# Altium schematic sheet Sheet1.SchDoc (part 1 of 2)
size A2; SheetNumber: 1; SheetTotal: 1
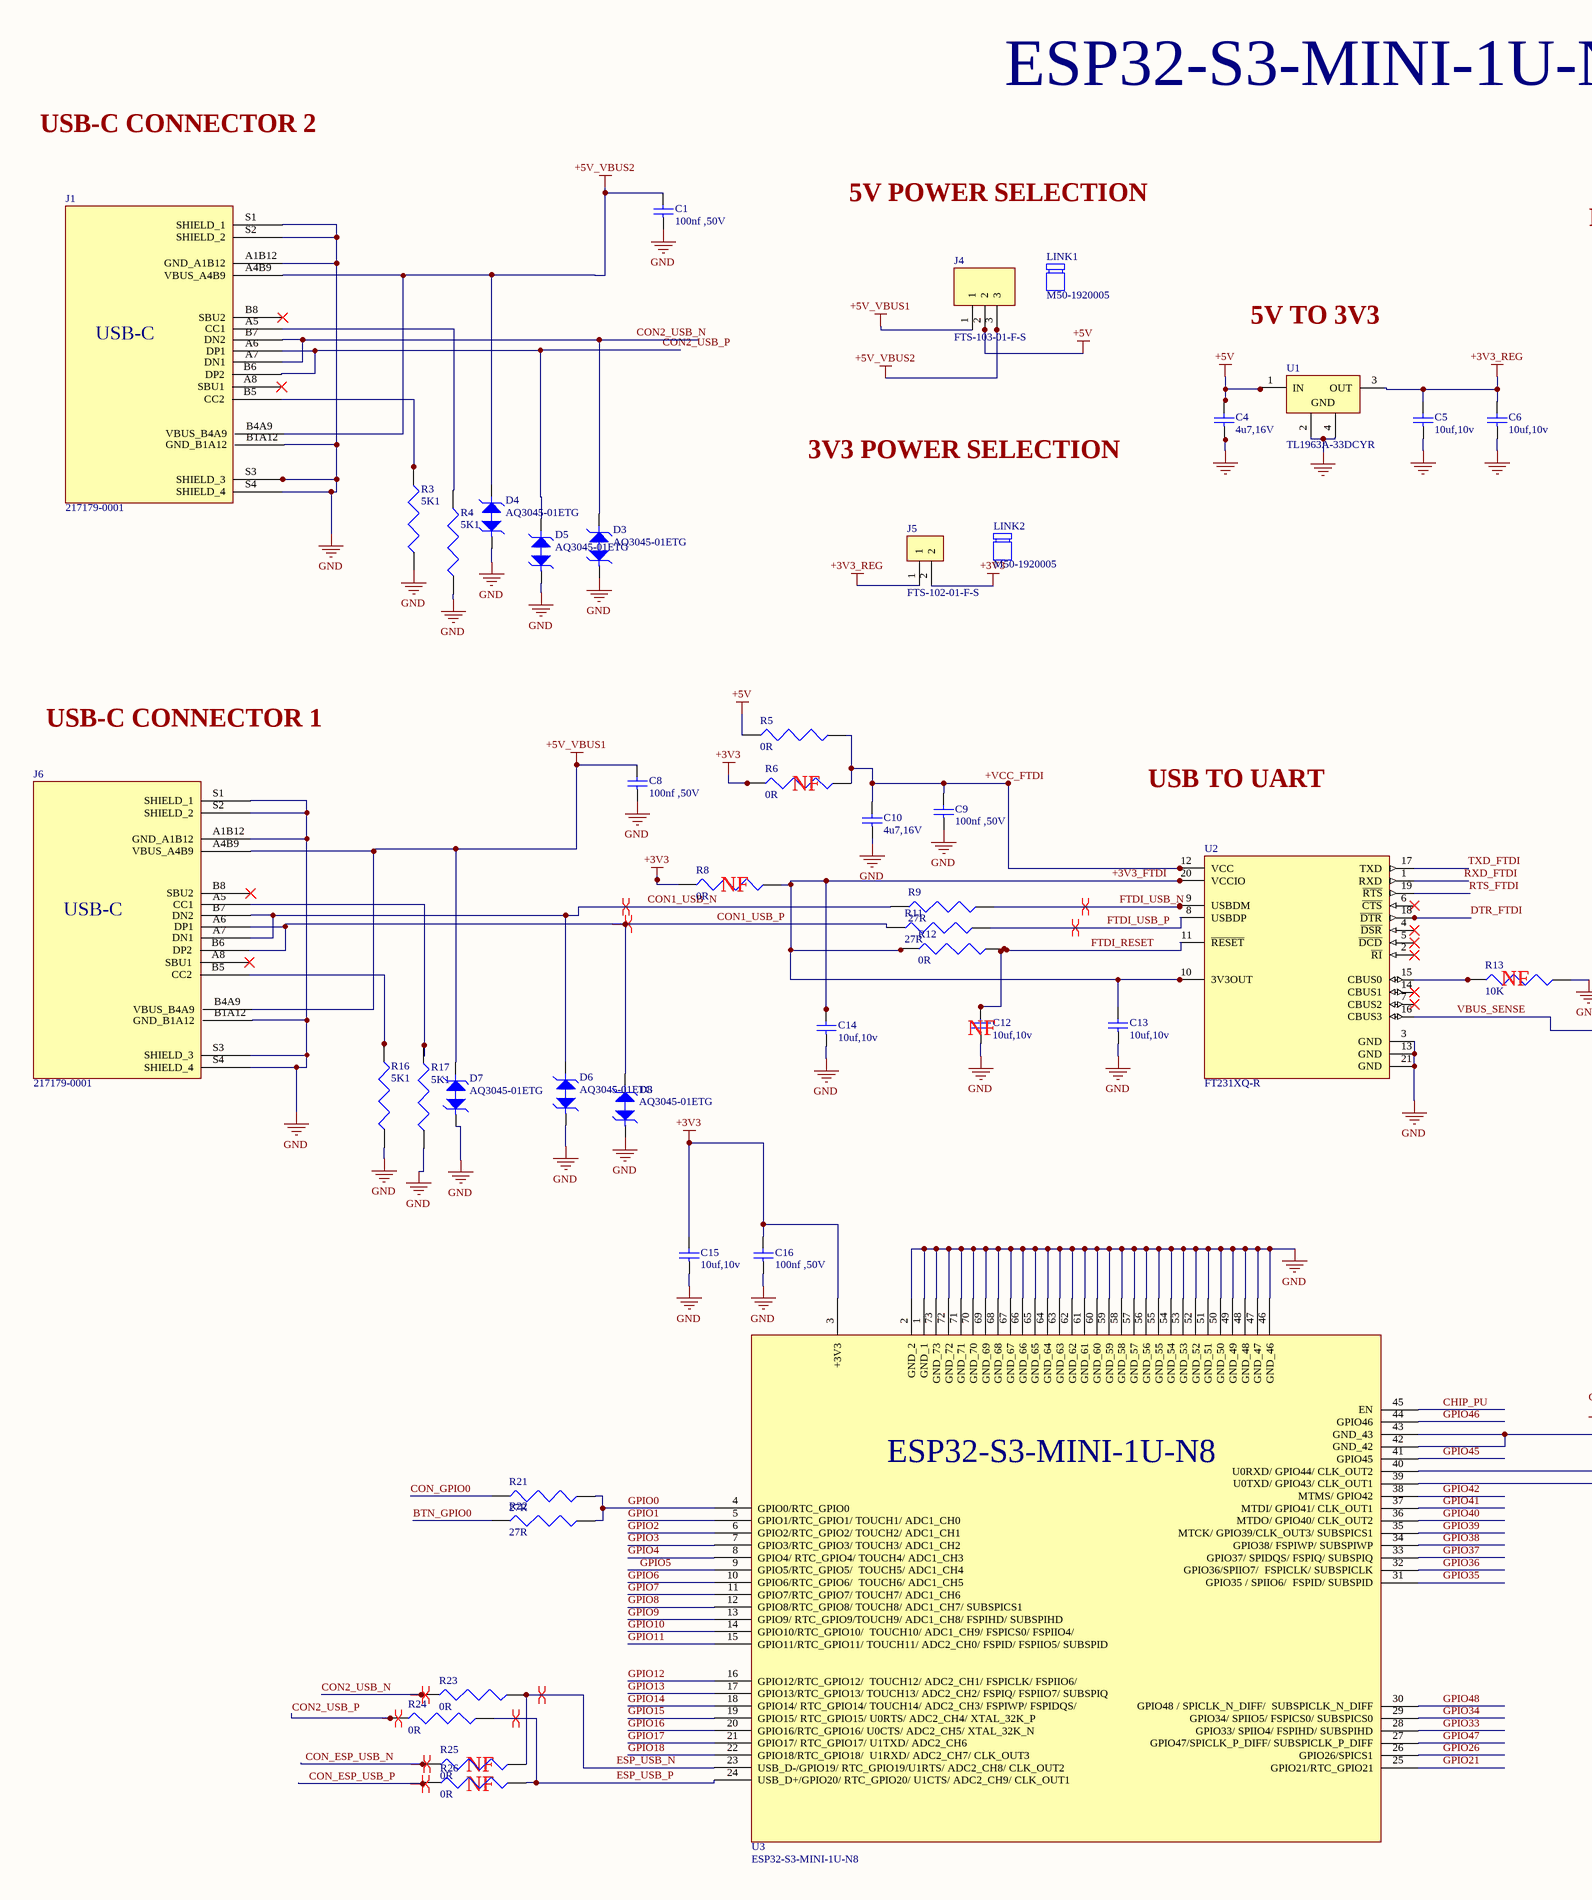
[diagram p0: Sheet1.SchDoc, left]
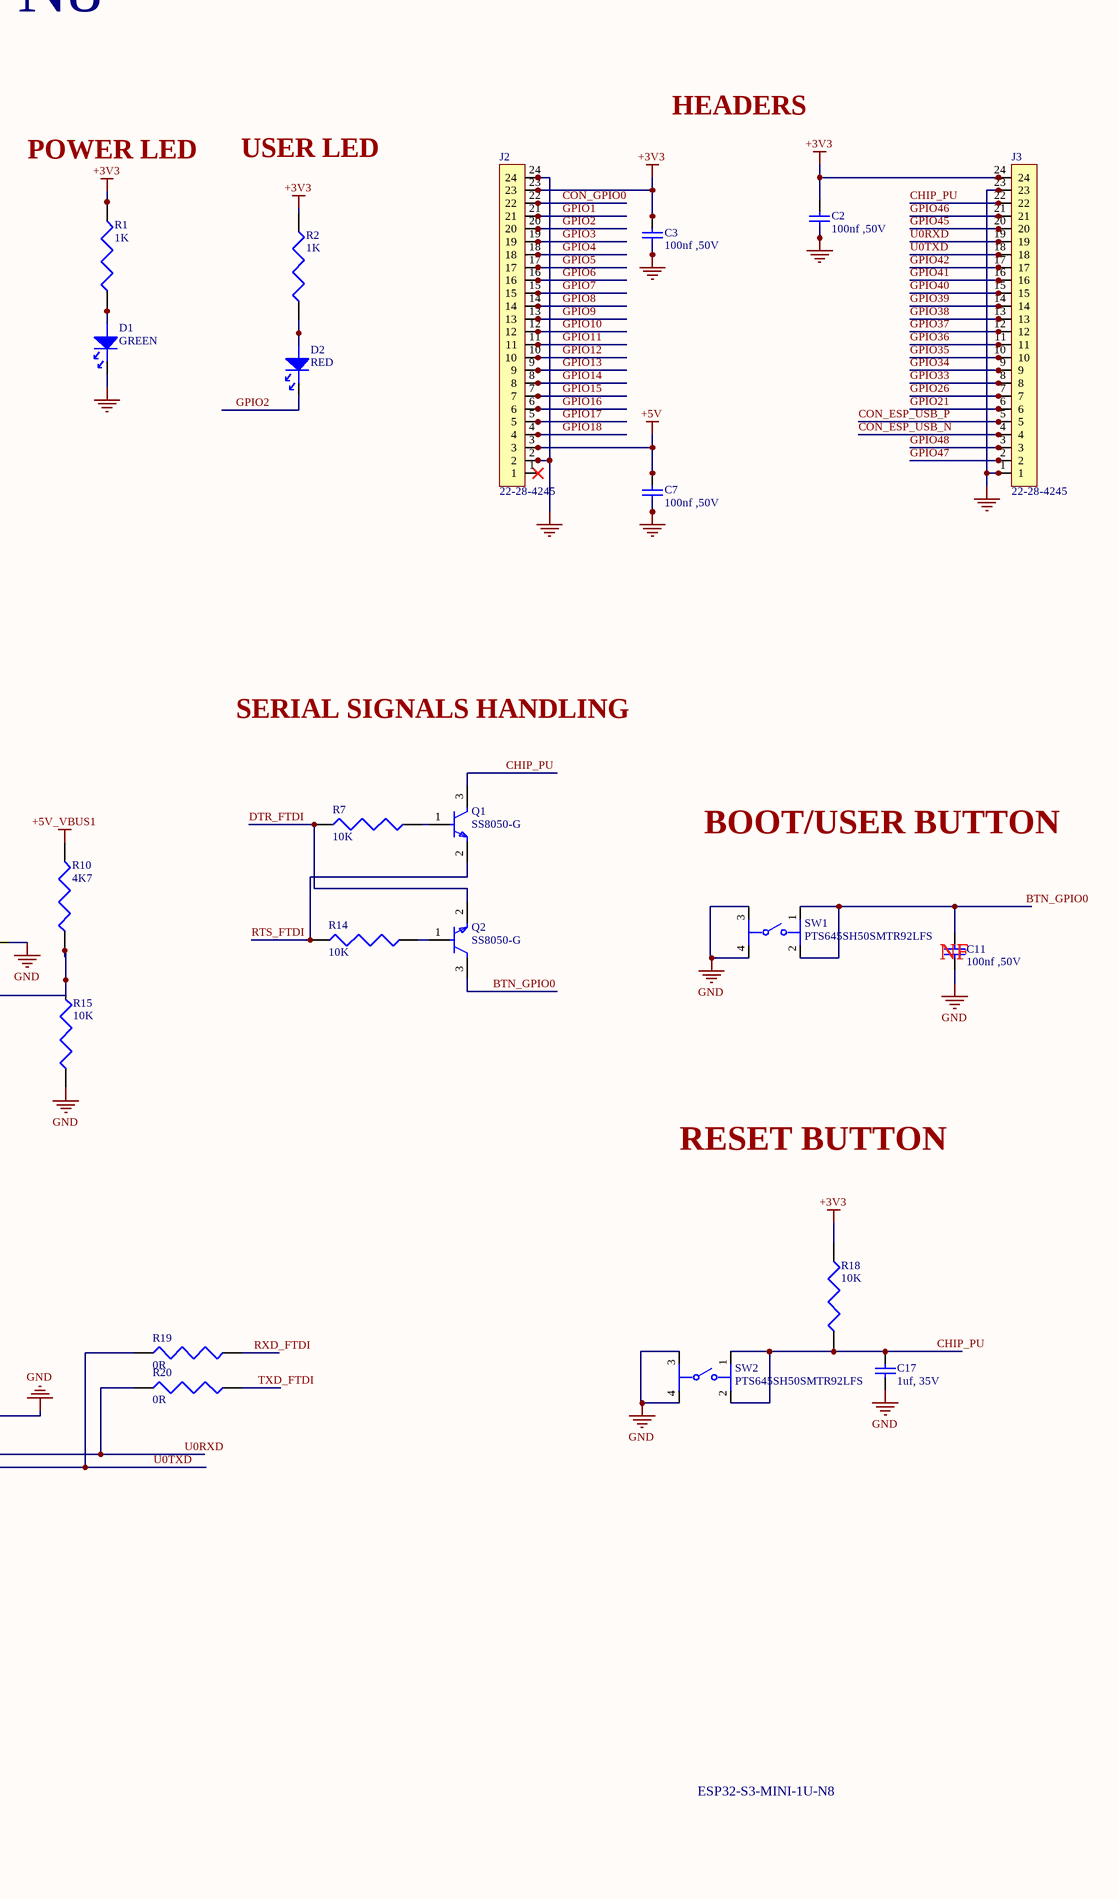
[diagram p1: Sheet1.SchDoc, right]

## Parts
C1  100nf ,50V  [CAPC1005X70N]
C2  100nf ,50V  [CAPC1005X70N]
C3  100nf ,50V  [CAPC1005X70N]
C4  4u7,16V  [CAPC1005X70N]
C5  10uf,10v  [CAPC1005X70N]
C6  10uf,10v  [CAPC1005X70N]
C7  100nf ,50V  [CAPC1005X70N]
C8  100nf ,50V  [CAPC1005X70N]
C9  100nf ,50V  [CAPC1005X70N]
C10  4u7,16V  [CAPC1005X70N]
C11  100nf ,50V  [CAPC1005X70N]
C12  10uf,10v  [CAPC1005X70N]
C13  10uf,10v  [CAPC1005X70N]
C14  10uf,10v  [CAPC1005X70N]
C15  10uf,10v  [CAPC1005X70N]
C16  100nf ,50V  [CAPC1005X70N]
C17  1uf, 35V  [CAPC1005X70N]
D1  GREEN  [LED0402G]
D2  RED  [LED0402G]
D3  AQ3045-01ETG  [SOD882]
D4  AQ3045-01ETG  [SOD882]
D5  AQ3045-01ETG  [SOD882]
D6  AQ3045-01ETG  [SOD882]
D7  AQ3045-01ETG  [SOD882]
D8  AQ3045-01ETG  [SOD882]
J1  217179-0001  [FP-2171790001-MFG]
J2  22-28-4245  [HDR_1X24_2.54mm]
J3  22-28-4245  [HDR_1X24_2.54mm]
J4  FTS-103-01-F-S  [HDR_1X3_2.54mm - duplicate]
J5  FTS-102-01-F-S  [HDR_1X2_2.54mm]
J6  217179-0001  [FP-2171790001-MFG]
LINK1  M50-1920005  (mechanical)
LINK2  M50-1920005  (mechanical)
Q1  SS8050-G  [FP-SS8050-G-IPC_B]
Q2  SS8050-G  [FP-SS8050-G-IPC_B]
R1  1K  [RESC1005X37N]
R2  1K  [RESC1005X37N]
R3  5K1  [RESC1005X37N]
R4  5K1  [RESC1005X37N]
R5  0R  [RESC1005X37N]
R6  0R  [RESC1005X37N]
R7  10K  [RESC1005X37N]
R8  0R  [RESC1005X37N]
R9  27R  [RESC1005X37N]
R10  4K7  [RESC1005X37N]
R11  27R  [RESC1005X37N]
R12  0R  [RESC1005X37N]
R13  10K  [RESC1005X37N]
R14  10K  [RESC1005X37N]
R15  10K  [RESC1005X37N]
R16  5K1  [RESC1005X37N]
R17  5K1  [RESC1005X37N]
R18  10K  [RESC1005X37N]
R19  0R  [RESC1005X37N]
R20  0R  [RESC1005X37N]
R21  27R  [RESC1005X37N]
R22  27R  [RESC1005X37N]
R23  0R  [RESC1005X37N]
R24  0R  [RESC1005X37N]
R25  0R  [RESC1005X37N]
R26  0R  [RESC1005X37N]
SW1  PTS645SH50SMTR92LFS  [FP-PTS645SH50SMTR92LFS-MFG]
SW2  PTS645SH50SMTR92LFS  [FP-PTS645SH50SMTR92LFS-MFG]
U1  TL1963A-33DCYR  [TL1963A-33DCYR]
U2  FT231XQ-R  [FP-QFN-20-IPC_B]
U3  ESP32-S3-MINI-1U-N8  [XCVR_ESP32-S3-MINI-1-N8]

## Nets
+3V3: C2.2 C3.2 C15.2 C16.2 J2.23 J3.24 J5.2 R1.2 R2.2 R6.1 R8.1 R18.2 U3.3(+3V3)
+3V3_REG: C5.2 C6.2 J5.1 U1.3(OUT)
+5V: C4.2 C7.2 J2.3 J4.2 R5.2 U1.1(IN)
+5V_VBUS1: C8.2 D7.2 J4.1 J6.A4B9(VBUS_A4B9) J6.B4A9(VBUS_B4A9) R10.2
+5V_VBUS2: C1.2 D4.2 J1.A4B9(VBUS_A4B9) J1.B4A9(VBUS_B4A9) J4.3
GND: C1.1 C2.1 C3.1 C4.1 C5.1 C6.1 C7.1 C8.1 C9.1 C10.1 C11.1 C12.1 C13.1 C14.1 C15.1 C16.1 C17.1 D1.1 D3.1 D4.1 D5.1 D6.1 D7.1 D8.1 J1.A1B12(GND_A1B12) J1.B1A12(GND_B1A12) J1.S1(SHIELD_1) J1.S2(SHIELD_2) J1.S3(SHIELD_3) J1.S4(SHIELD_4) J2.2 J2.24 J3.1 J3.23 J6.A1B12(GND_A1B12) J6.B1A12(GND_B1A12) J6.S1(SHIELD_1) J6.S2(SHIELD_2) J6.S3(SHIELD_3) J6.S4(SHIELD_4) R3.1 R4.1 R13.2 R15.2 R16.1 R17.1 SW1.3 SW1.4 SW2.3 SW2.4 U1.2(GND) U1.4(GND) U2.3(GND) U2.13(GND) U2.21(GND) U3.1(GND_1) U3.2(GND_2) U3.42(GND_42) U3.43(GND_43) U3.46(GND_46) U3.47(GND_47) U3.48(GND_48) U3.49(GND_49) U3.50(GND_50) U3.51(GND_51) U3.52(GND_52) U3.53(GND_53) U3.54(GND_54) U3.55(GND_55) U3.56(GND_56) U3.57(GND_57) U3.58(GND_58) U3.59(GND_59) U3.60(GND_60) U3.61(GND_61) U3.62(GND_62) U3.63(GND_63) U3.64(GND_64) U3.65(GND_65) U3.66(GND_66) U3.67(GND_67) U3.68(GND_68) U3.69(GND_69) U3.70(GND_70) U3.71(GND_71) U3.72(GND_72) U3.73(GND_73)
+3V3_FTDI: C13.2 C14.2 R8.2 R12.1 U2.10(3V3OUT) U2.20(VCCIO)
+VCC_FTDI: C9.2 C10.2 R5.1 R6.2 U2.12(VCC)
BTN_GPIO0: C11.2 Q2.3(C) R22.1 SW1.1 SW1.2
CHIP_PU: C17.2 J3.22 Q1.3(C) R18.1 SW2.1 SW2.2 U3.45(EN)
CON1_USB_N: D6.2 J6.A7(DN1) J6.B7(DN2) R9.1
CON1_USB_P: D8.2 J6.A6(DP1) J6.B6(DP2) R11.1
CON2_USB_N: D3.2 J1.A7(DN1) J1.B7(DN2) R23.1
CON2_USB_P: D5.2 J1.A6(DP1) J1.B6(DP2) R24.1
CON_ESP_USB_N: J3.4 R25.1
CON_ESP_USB_P: J3.5 R26.1
CON_GPIO0: J2.22 R21.1
DTR_FTDI: Q2.2(E) R7.1 U2.18(~{DTR})
ESP_USB_N: R23.2 R25.2 U3.23(USB_D-/GPIO19/_RTC_GPIO19/U1RTS/_ADC2_CH8/_CLK_OUT2)
ESP_USB_P: R24.2 R26.2 U3.24(USB_D+/GPIO20/_RTC_GPIO20/_U1CTS/_ADC2_CH9/_CLK_OUT1)
FTDI_RESET: C12.2 R12.2 U2.11(~{RESET})
FTDI_USB_N: R9.2 U2.9(USBDM)
FTDI_USB_P: R11.2 U2.8(USBDP)
GPIO0: R21.2 R22.2 U3.4(GPIO0/RTC_GPIO0)
GPIO1: J2.21 U3.5(GPIO1/RTC_GPIO1/_TOUCH1/_ADC1_CH0)
GPIO2: D2.1 J2.20 U3.6(GPIO2/RTC_GPIO2/_TOUCH2/_ADC1_CH1)
GPIO3: J2.19 U3.7(GPIO3/RTC_GPIO3/_TOUCH3/_ADC1_CH2)
GPIO4: J2.18 U3.8(GPIO4/_RTC_GPIO4/_TOUCH4/_ADC1_CH3)
GPIO5: J2.17 U3.9(GPIO5/RTC_GPIO5/__TOUCH5/_ADC1_CH4)
GPIO6: J2.16 U3.10(GPIO6/RTC_GPIO6/__TOUCH6/_ADC1_CH5)
GPIO7: J2.15 U3.11(GPIO7/RTC_GPIO7/_TOUCH7/_ADC1_CH6)
GPIO8: J2.14 U3.12(GPIO8/RTC_GPIO8/_TOUCH8/_ADC1_CH7/_SUBSPICS1)
GPIO9: J2.13 U3.13(GPIO9/_RTC_GPIO9/TOUCH9/_ADC1_CH8/_FSPIHD/_SUBSPIHD)
GPIO10: J2.12 U3.14(GPIO10/RTC_GPIO10/__TOUCH10/_ADC1_CH9/_FSPICS0/_FSPIIO4/)
GPIO11: J2.11 U3.15(GPIO11/RTC_GPIO11/_TOUCH11/_ADC2_CH0/_FSPID/_FSPIIO5/_SUBSPID)
GPIO12: J2.10 U3.16(GPIO12/RTC_GPIO12/__TOUCH12/_ADC2_CH1/_FSPICLK/_FSPIIO6/)
GPIO13: J2.9 U3.17(GPIO13/RTC_GPIO13/_TOUCH13/_ADC2_CH2/_FSPIQ/_FSPIIO7/_SUBSPIQ)
GPIO14: J2.8 U3.18(GPIO14/_RTC_GPIO14/_TOUCH14/_ADC2_CH3/_FSPIWP/_FSPIDQS/)
GPIO15: J2.7 U3.19(GPIO15/_RTC_GPIO15/_U0RTS/_ADC2_CH4/_XTAL_32K_P)
GPIO16: J2.6 U3.20(GPIO16/RTC_GPIO16/_U0CTS/_ADC2_CH5/_XTAL_32K_N)
GPIO17: J2.5 U3.21(GPIO17/_RTC_GPIO17/_U1TXD/_ADC2_CH6)
GPIO18: J2.4 U3.22(GPIO18/RTC_GPIO18/__U1RXD/_ADC2_CH7/_CLK_OUT3)
GPIO21: J3.6 U3.25(GPIO21/RTC_GPIO21)
GPIO26: J3.7 U3.26(GPIO26/SPICS1)
GPIO33: J3.8 U3.28(GPIO33/_SPIIO4/_FSPIHD/_SUBSPIHD)
GPIO34: J3.9 U3.29(GPIO34/_SPIIO5/_FSPICS0/_SUBSPICS0)
GPIO35: J3.10 U3.31(GPIO35_/_SPIIO6/__FSPID/_SUBSPID)
GPIO36: J3.11 U3.32(GPIO36/SPIIO7/__FSPICLK/_SUBSPICLK)
GPIO37: J3.12 U3.33(GPIO37/_SPIDQS/_FSPIQ/_SUBSPIQ)
GPIO38: J3.13 U3.34(GPIO38/_FSPIWP/_SUBSPIWP)
GPIO39: J3.14 U3.35(MTCK/_GPIO39/CLK_OUT3/_SUBSPICS1)
GPIO40: J3.15 U3.36(MTDO/_GPIO40/_CLK_OUT2)
GPIO41: J3.16 U3.37(MTDI/_GPIO41/_CLK_OUT1)
GPIO42: J3.17 U3.38(MTMS/_GPIO42)
GPIO45: J3.20 U3.41(GPIO45)
GPIO46: J3.21 U3.44(GPIO46)
GPIO47: J3.2 U3.27(GPIO47/SPICLK_P_DIFF/_SUBSPICLK_P_DIFF)
GPIO48: J3.3 U3.30(GPIO48_/_SPICLK_N_DIFF/__SUBSPICLK_N_DIFF)
RTS_FTDI: Q1.2(E) R14.1 U2.19(~{RTS})
RXD_FTDI: R19.2 U2.1(RXD)
TXD_FTDI: R20.2 U2.17(TXD)
U0RXD: J3.19 R20.1 U3.40(U0RXD/_GPIO44/_CLK_OUT2)
U0TXD: J3.18 R19.1 U3.39(U0TXD/_GPIO43/_CLK_OUT1)
VBUS_SENSE: R10.1 R15.1 U2.16(CBUS3)
NetD1_2: D1.2 R1.1
NetD2_2: D2.2 R2.1
NetJ1_A5: J1.A5(CC1) R4.2
NetJ1_B5: J1.B5(CC2) R3.2
NetJ6_A5: J6.A5(CC1) R17.2
NetJ6_B5: J6.B5(CC2) R16.2
NetQ1_1: Q1.1(B) R7.2
NetQ2_1: Q2.1(B) R14.2
NetR13_1: R13.1 U2.15(CBUS0)

Not connected (* = marked no-connect by the designer): J1 A8(SBU1)* B8(SBU2)*; J2 1*; J6 A8(SBU1)* B8(SBU2)*; U2 2(~{RI})* 4(~{DSR})* 5(~{DCD})* 6(~{CTS})* 7(CBUS2)* 14(CBUS1)*

## Layout directives
differential pair; differential pair class DIFF90: CON1_USB_N, CON1_USB_P, CON2_USB_N, CON2_USB_P, CON_ESP_USB_N, CON_ESP_USB_P, ESP_USB_N, ESP_USB_P, FTDI_USB_N, FTDI_USB_P

## Notes on the sheet
- USB-C CONNECTOR 2
- ESP32-S3-MINI-1U-N8
- 5V POWER SELECTION
- USER LED
- HEADERS
- POWER LED
- 5V TO 3V3
- 3V3 POWER SELECTION
- USB-C CONNECTOR 1
- SERIAL SIGNALS HANDLING
- (near R6) NF
- USB TO UART
- BOOT/USER BUTTON
- (near R8) NF
- (near R13) NF
- (near C11) NF
- (near C12) NF
- RESET BUTTON
- (near R25) NF
- (near R26) NF
- (in symbol 217179-0001) USB-C